# Altium schematic sheet Beam_Amp.SchDoc
size Tabloid
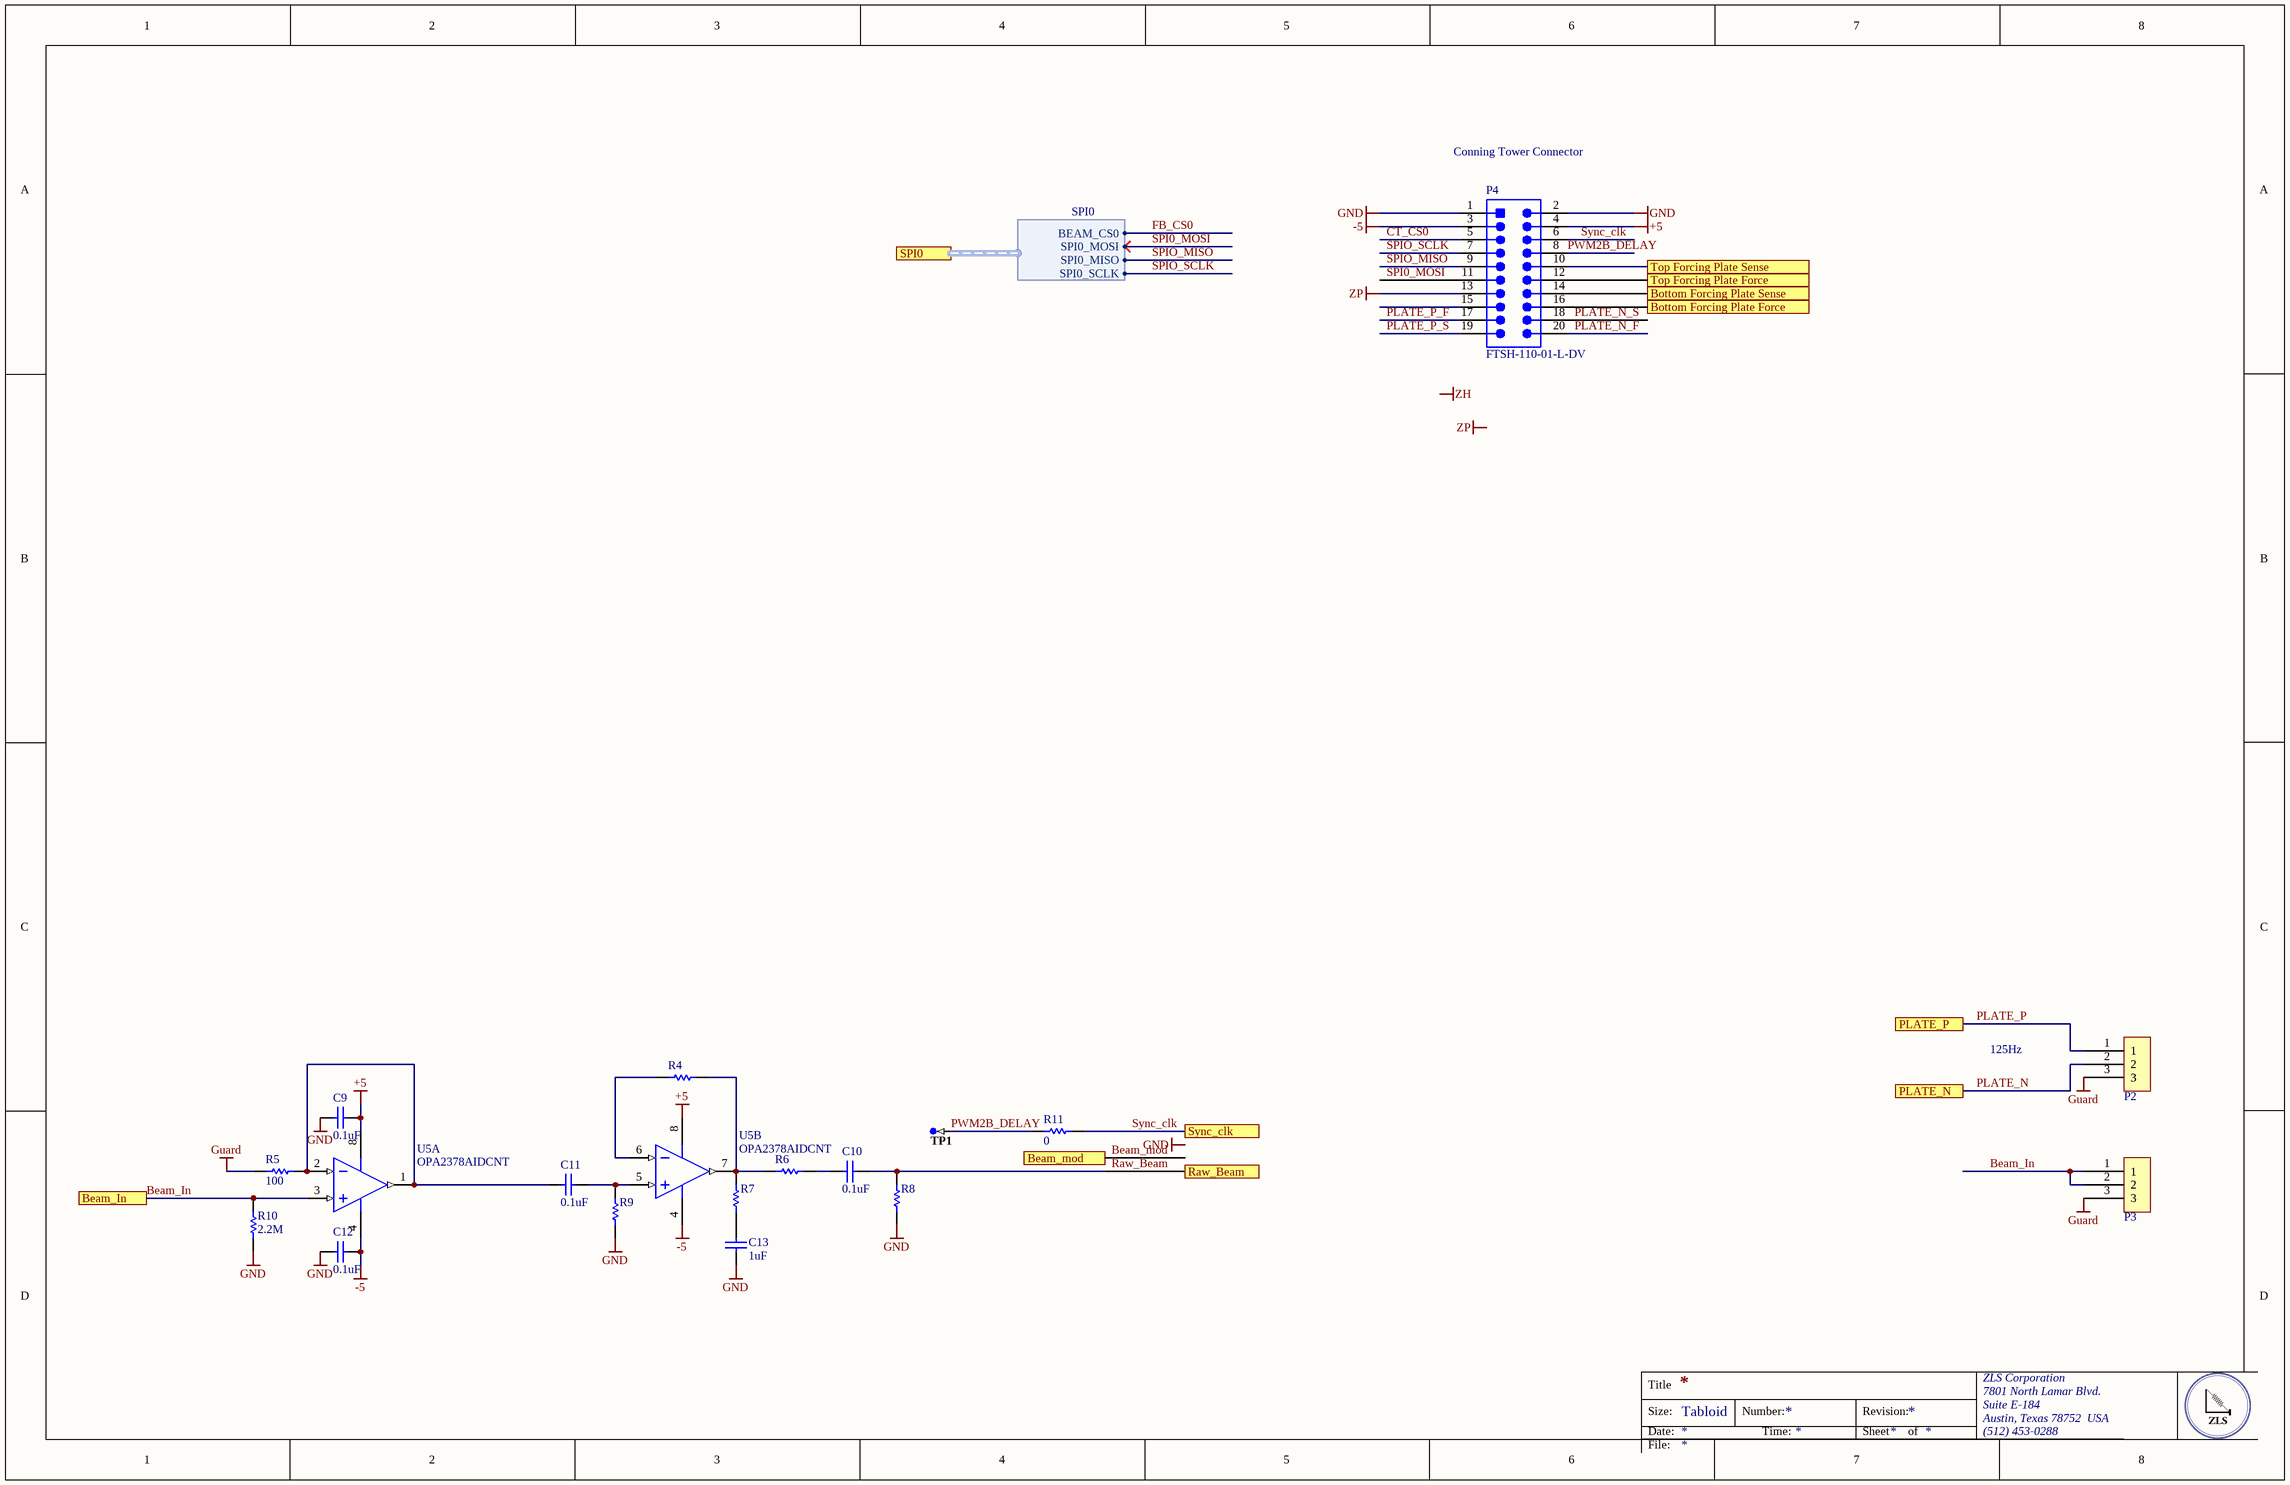
[diagram p0: Beam_Amp.SchDoc]

## Parts
C9  0.1uF  [CAPC0402(1005)60_L]
C10  0.1uF  [CAPC0402(1005)60_L]
C11  0.1uF  [CAPC0402(1005)60_L]
C12  0.1uF  [CAPC0402(1005)60_L]
C13  1uF  [CAPC0402(1005)60_L]
P2  Triax_Conn  [Triax_Conn]  (value not drawn)
P3  Triax_Conn  [Triax_Conn]  (value not drawn)
P4  FTSH-110-01-L-DV  [SMTC-FTSH-110-01-L-DV_V]
R4  (no value)  [RESC0402(1005)_M]
R5  100  [RESC0402(1005)_M]
R6  (no value)  [RESC0402(1005)_M]
R7  (no value)  [RESC0402(1005)_M]
R8  (no value)  [RESC0402(1005)_M]
R9  (no value)  [RESC0402(1005)_M]
R10  2.2M  [RESC0402(1005)_M]
R11  0  [RESC0805(2012)_L]
TP1  TP-SM-C-100  [TP-SM-C-100]  (value not drawn)  (no BOM)
U5  OPA2378AIDCNT  [DCN0008A_M]  (parts A,B of 2)

## Ports
Beam_In, Beam_mod, Bottom Forcing Plate Force, Bottom Forcing Plate Sense, PLATE_N, PLATE_P, Raw_Beam, SPI0 (harness SPI0), Sync_clk, Top Forcing Plate Force, Top Forcing Plate Sense

## Harnesses
SPI0: BEAM_CS0, SPI0_MOSI, SPI0_MISO, SPI0_SCLK

## Nets
+5: C9.2 P4.4 U5.8(V+)
-5: C12.2 P4.3 U5.4(V-)
GND: C9.1 C12.1 C13.1 P4.1 P4.2 R8.2 R9.2 R10.1
Guard: P2.3 P3.3 R5.2
ZP: P4.13
Beam_In: P3.1 P3.2 R10.2 U5.3(IN_A+) ; port Beam_In
Beam_mod: port Beam_mod
Bottom Forcing Plate Force: P4.16 ; port Bottom Forcing Plate Force
Bottom Forcing Plate Sense: P4.14 ; port Bottom Forcing Plate Sense
CT_CS0: P4.5
FB_CS0: port SPI0.BEAM_CS0
PLATE_N: P2.2 ; port PLATE_N
PLATE_N_F: P4.20
PLATE_N_S: P4.18
PLATE_P: P2.1 ; port PLATE_P
PLATE_P_F: P4.17
PLATE_P_S: P4.19
PWM2B_DELAY: P4.8 R11.1 TP1.1
Raw_Beam: C10.2 R8.1 ; port Raw_Beam
SPI0_MOSI: P4.11 ; port SPI0.SPI0_MOSI
SPIO_MISO: P4.9 ; port SPI0.SPI0_MISO
SPIO_SCLK: P4.7 ; port SPI0.SPI0_SCLK
Sync_clk: P4.6 R11.2 ; port Sync_clk
Top Forcing Plate Force: P4.12 ; port Top Forcing Plate Force
Top Forcing Plate Sense: P4.10 ; port Top Forcing Plate Sense
NetC10_1: C10.1 R6.1
NetC11_1: C11.1 R5.1 U5.1(OUT_A) U5.2(IN_A-)
NetC11_2: C11.2 R9.1 U5.5(IN_B+)
NetC13_2: C13.2 R7.2
NetR4_1: R4.1 R6.2 R7.1 U5.7(OUT_B)
NetR4_2: R4.2 U5.6(IN_B-)

Not connected (* = marked no-connect by the designer): P4 15

## Notes on the sheet
- Conning Tower Connector
- 125Hz
- Labels drawn without touching a wire or pin: GND, ZH, ZP
- Title
- Size:
- Date:
- Tabloid
- Number:
- Time:
- Revision:
- Sheet
- of
- ZLS Corporation
- 7801 North Lamar Blvd.
- Suite E-184
- Austin, Texas 78752  USA
- (512) 453-0288
- File:

## Library data of the parts
C9-C13 = CMP-1034-00252-1: CAP CER 0.1UF 10V X7R 0402; Manufacturer: Murata Electronics North America; Manufacturer Part Number: GRM155R71A104KA01D; Tolerance: ±10%; Supplier 1: Digi-Key; Supplier Part Number 1: 490-6321-1-ND; RoHS: RoHS Compliant; Category: Capacitors; Stock 1: 2920395; Pricing 1: 1=0.1, 10=0.014, 100=0.0063, 500=0.00446, 1000=0.00351, 2500=0.00319, 5000=0.00293 (USD); Packaging: Cut Tape (CT); Part Status: Active; Voltage - Rated: 10V; Temperature Coefficient: X7R; Operating Temperature: -55°C ~ 125°C; Features: -; Ratings: -; Applications: General Purpose; Mounting Type: Surface Mount, MLCC; Package / Case: 0402 (1005 Metric); Size / Dimension: 0.039" L x 0.020" W (1.00mm x 0.50mm); Height - Seated (Max): -; Thickness (Max): 0.022" (0.55mm); Lead Spacing: -; ComponentLink1URL: http://www.murata.com/~/media/webrenewal/support/library/catalog/products/capacitor/mlcc/c02e.ashx?la=en-us; ComponentLink1Description: http://www.murata.com/~/media/webrenewal/support/library/catalog/products/capacitor/mlcc/c02e.ashx?la=en-us
P4 = CMP-2000-06294-2: Male Header, Pitch 1.27 mm, 2 x 10 Position, Height 6.1 mm, -55 to 125 degC, RoHS, Tube; Manufacturer: Samtec; Online Catalog: FTSHSeries; Number of Positions Loaded: All; Connector Type: Header,Unshrouded; Product Training Modules: Board-to-BoardConnectors; Featured Product: Board-To-BoardInterconnectSystems; Other Names: SAM1161-10; EDA / CAD Models: DownloadfromAcceleratedDesigns; Number of Positions: 20; Catalog Drawings: FTSHSeriesFTSHSeriesSMTSide; Package Reference: FTSH-110-01-L-DV; Family: RectangularConnectors-Headers,MalePins; Mounting Technology: SurfaceMount; Contact Type: MalePin; Manufacturer URL: http://www.samtec.com/; Package URL: http://suddendocs.samtec.com/prints/ftsh-1xx-xx-xxx-dv-xxx-xxx-mkt.pdf; Package Description: Male Header, Pitch 1.27 mm, 2 x 10 Position, Height 6.1 mm; Packaging: Bulk; Termination: Solder; Category: Connectors,Interconnects; Fastening Type: -; Datasheet Version: F-215 , 02/2016; Contact Finish Thickness: 10µin(0.25µm); Number of Rows: 2; Datasheet URL: http://suddendocs.samtec.com/catalog_english/ftsh_smt.pdf; Mounting Type: SurfaceMount; Series: FTSH; Features: -; Contact Finish: Gold; Standard Package: 1; Color: Black
R4-R10 = CMP-1011-00463-1
R11 = CMP-1013-00215-1: RES SMD 0 OHM JUMPER 1/8W 0805; Manufacturer: Panasonic Electronic Components; Manufacturer Part Number: ERJ-6GEY0R00V; Power (Watts): 0.125W, 1/8W; Supplier 1: Digi-Key; Supplier Part Number 1: P0.0ACT-ND; RoHS: RoHS Compliant; Category: Resistors; Stock 1: 3414819; Pricing 1: 1=0.1, 10=0.074, 25=0.0532, 50=0.0406, 100=0.03, 250=0.02288, 500=0.0183, 1000=0.01347 (USD); Packaging: Cut Tape (CT); Part Status: Active; Tolerance: Jumper; Composition: Thick Film; Features: Automotive AEC-Q200; Temperature Coefficient: -; Operating Temperature: -55°C ~ 155°C; Package / Case: 0805 (2012 Metric); Supplier Device Package: 0805; Size / Dimension: 0.079" L x 0.049" W (2.00mm x 1.25mm); Height - Seated (Max): 0.028" (0.70mm); Failure Rate: -; ComponentLink1URL: http://industrial.panasonic.com/www-cgi/jvcr13pz.cgi?E+PZ+3+AOA0001+ERJ6GEY0R00V+7+WW; ComponentLink1Description: http://industrial.panasonic.com/www-cgi/jvcr13pz.cgi?E+PZ+3+AOA0001+ERJ6GEY0R00V+7+WW
TP1 = CMP-0484-00002-2: Test Point, Surface Mount, Circular, Pad Diameter 1 mm; Manufacturer: No Vendor; PartNumber: TP-SM-C-100
U5 = CMP-0272-01124-3: Low-Noise, 900 kHz, RRIO, Precision Operational Amplifier, Zero-Drift Series, 2.2 to 5.5 V, -40 to 125 degC, 8-pin SOP (DCN8), Green (RoHS & no Sb/Br); Manufacturer: Texas Instruments; Number of Channels: 2; Offset Drift(Typ)(uV/C): 0.25; Total Supply Voltage(Min)(+5V is 5, +/-5V is 10): 2.2; Vn at 1kHz(Typ)(nV/rtHz): 20; Iq per channel(Max)(mA): 0.15; Total Supply Voltage(Max)(+5V is 5, +/-5V is 10): 5.5; Sub Family: Low Offset Voltage Amplifier (<=500uV), Low Power Amp (<=500uA), Low Supply Voltage Amplifier (<=2.7V), Precision Amplifier, Zero Drift Precision Amplifier; IIB(Max)(pA): 550; Vio (25C)(Max)(mV): 0.07; CMRR(Min)(dB): 100; Slew Rate(Typ)(V/us): 0.4; PartNumber: OPA2378AIDCNT; DatasheetVersion: SBOS417D; ComponentLink2Description: Datasheet; ComponentLink3URL: http://www.ti.com/lit/ml/mpds099c/mpds099c.pdf; ComponentLink2URL: http://www.ti.com/general/docs/lit/getliterature.tsp?genericPartNumber=OPA2378&fileType=pdf; PackageReference: DCN0008A; PackageDescription: 8-Pin Plastic Small Outline, Body 1.6 x 2.9 mm, Pitch 0.65 mm; Code_JEDEC: MO-178; PackageVersion: 4202106/D, 11/2009; ComponentLink3Description: Package Specification; Eco-Plan: Green (RoHS & no Sb/Br); ComponentLink1Description: Manufacturer URL; Mounting Technology: Surface Mount; ComponentLink1URL: http://www.ti.com/; PartId: 1